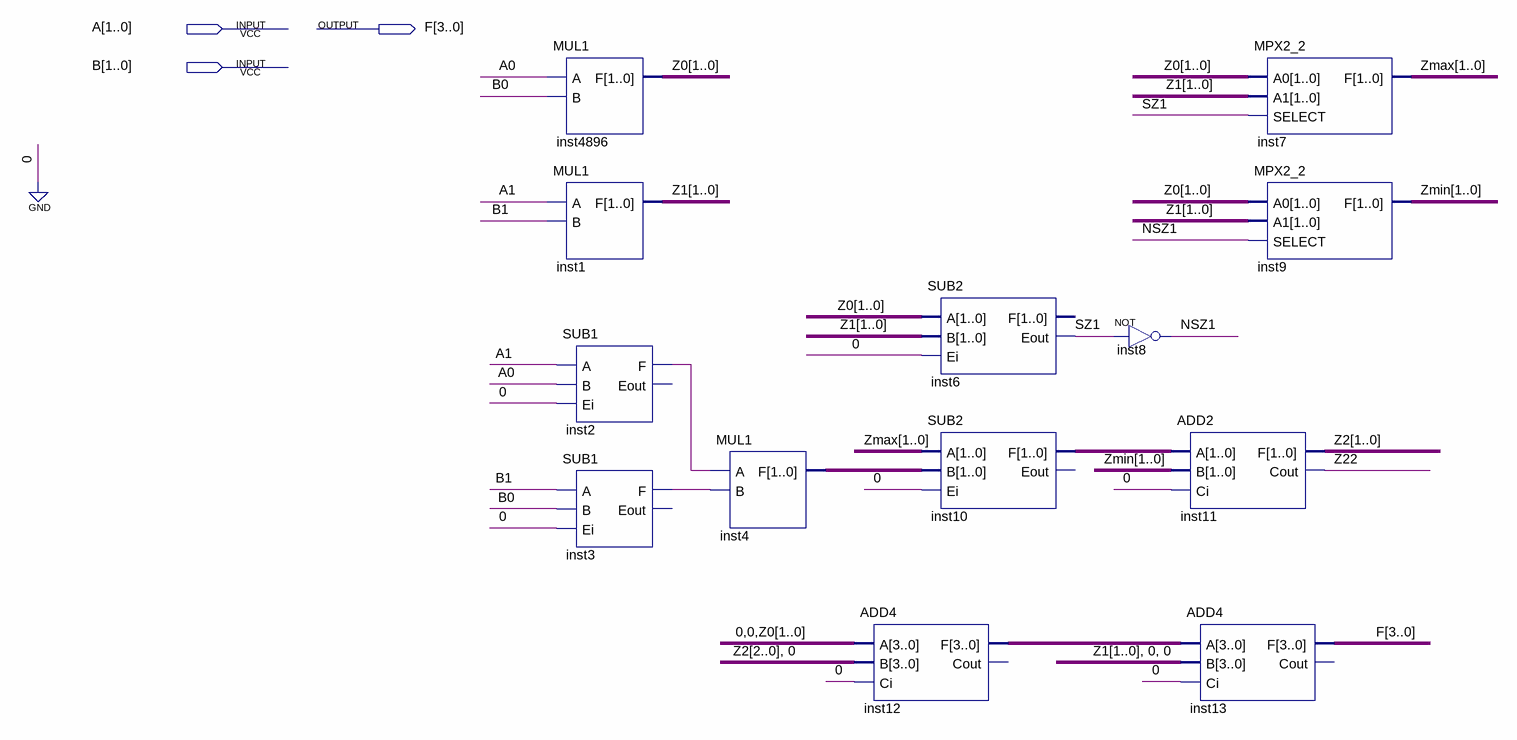
[diagram p0: schematic sheet]
// Quartus schematic MUL2.bdf as structural Verilog: 13 symbols, 3 pins
module MUL2 (
  input  [1:0] A,
  input  [1:0] B,
  output [3:0] F
);

  wire inst2_f, inst3_f, NSZ1, SZ1;
  wire [1:0] inst4_f, inst10_f, Z0, Z1, Zmax, Zmin;
  wire [2:0] Z2;
  wire [3:0] inst12_f;

  MUL1 inst4896 (.A(A[0]), .B(B[0]), .F(Z0));
  MUL1 inst1 (.A(A[1]), .B(B[1]), .F(Z1));
  SUB1 inst2 (.A(A[1]), .B(A[0]), .Ei(1'b0), .F(inst2_f));  // open: Eout
  SUB1 inst3 (.A(B[1]), .B(B[0]), .Ei(1'b0), .F(inst3_f));  // open: Eout
  MUL1 inst4 (.A(inst2_f), .B(inst3_f), .F(inst4_f));
  ADD4 inst12 (.A({2'b00, Z0}), .B({Z2, 1'b0}), .Ci(1'b0), .F(inst12_f));  // open: Cout
  SUB2 inst6 (.A(Z0), .B(Z1), .Ei(1'b0), .Eout(SZ1));  // open: F
  SUB2 inst10 (.A(Zmax), .B(inst4_f), .Ei(1'b0), .F(inst10_f));  // open: Eout
  not inst8 (NSZ1, SZ1);
  ADD2 inst11 (.A(inst10_f), .B(Zmin), .Ci(1'b0), .F(Z2[1:0]), .Cout(Z2[2]));
  MPX2_2 inst7 (.A0(Z0), .A1(Z1), .SELECT(SZ1), .F(Zmax));
  MPX2_2 inst9 (.A0(Z0), .A1(Z1), .SELECT(NSZ1), .F(Zmin));
  ADD4 inst13 (.A(inst12_f), .B({Z1, 2'b00}), .Ci(1'b0), .F(F));  // open: Cout
endmodule
